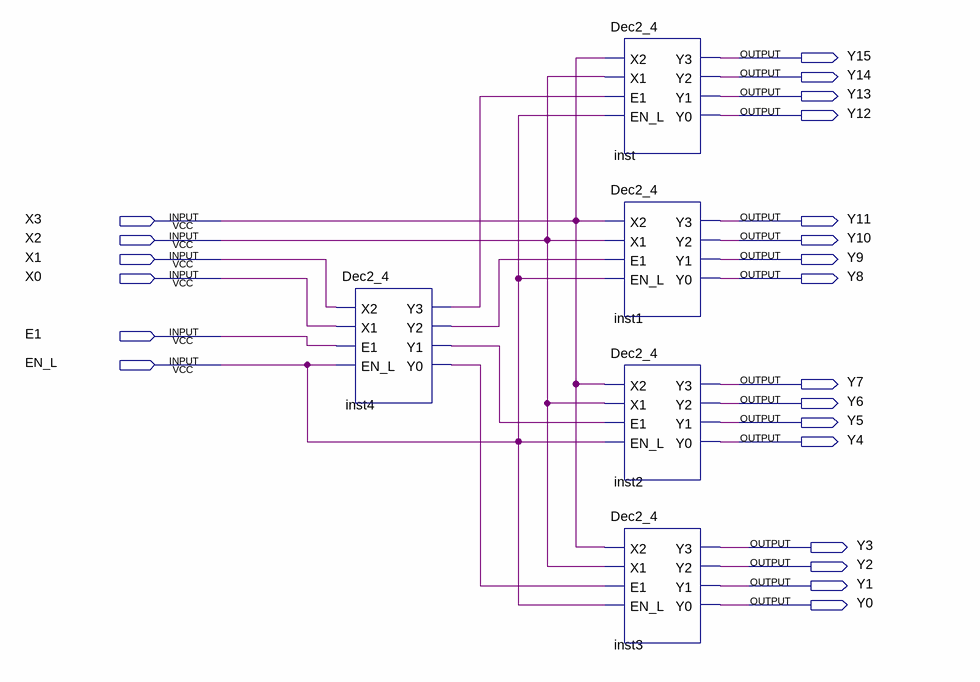
[diagram p0: schematic sheet]
// Quartus schematic Dec4_16.bdf as structural Verilog: 5 symbols, 22 pins
module Dec4_16 (
  input  X3,
  input  X2,
  input  X1,
  input  X0,
  input  E1,
  input  EN_L,
  output Y15,
  output Y14,
  output Y13,
  output Y12,
  output Y11,
  output Y10,
  output Y9,
  output Y8,
  output Y7,
  output Y6,
  output Y5,
  output Y4,
  output Y3,
  output Y2,
  output Y1,
  output Y0
);

  wire inst4_y0, inst4_y1, inst4_y2, inst4_y3;

  Dec2_4 inst4 (.X2(X1), .X1(X0), .E1(E1), .EN_L(EN_L), .Y3(inst4_y3), .Y2(inst4_y2), .Y1(inst4_y1), .Y0(inst4_y0));
  Dec2_4 inst (.X2(X3), .X1(X2), .E1(inst4_y3), .EN_L(EN_L), .Y3(Y15), .Y2(Y14), .Y1(Y13), .Y0(Y12));
  Dec2_4 inst1 (.X2(X3), .X1(X2), .E1(inst4_y2), .EN_L(EN_L), .Y3(Y11), .Y2(Y10), .Y1(Y9), .Y0(Y8));
  Dec2_4 inst2 (.X2(X3), .X1(X2), .E1(inst4_y1), .EN_L(EN_L), .Y3(Y7), .Y2(Y6), .Y1(Y5), .Y0(Y4));
  Dec2_4 inst3 (.X2(X3), .X1(X2), .E1(inst4_y0), .EN_L(EN_L), .Y3(Y3), .Y2(Y2), .Y1(Y1), .Y0(Y0));
endmodule
